# EasyEDA Pro project 3020包裹款控制板V1.1.eprj, schematic 原理图
Board Name: esp32; Create Date: 2025-05-14; Page Name: 电源; Project Name: FluidNC--esp32 -(12-31); Schematic Name: 原理图; Update Date: 2026-01-04; Company: 嘉立创EDA; Page Size: A3; Version: V1.0
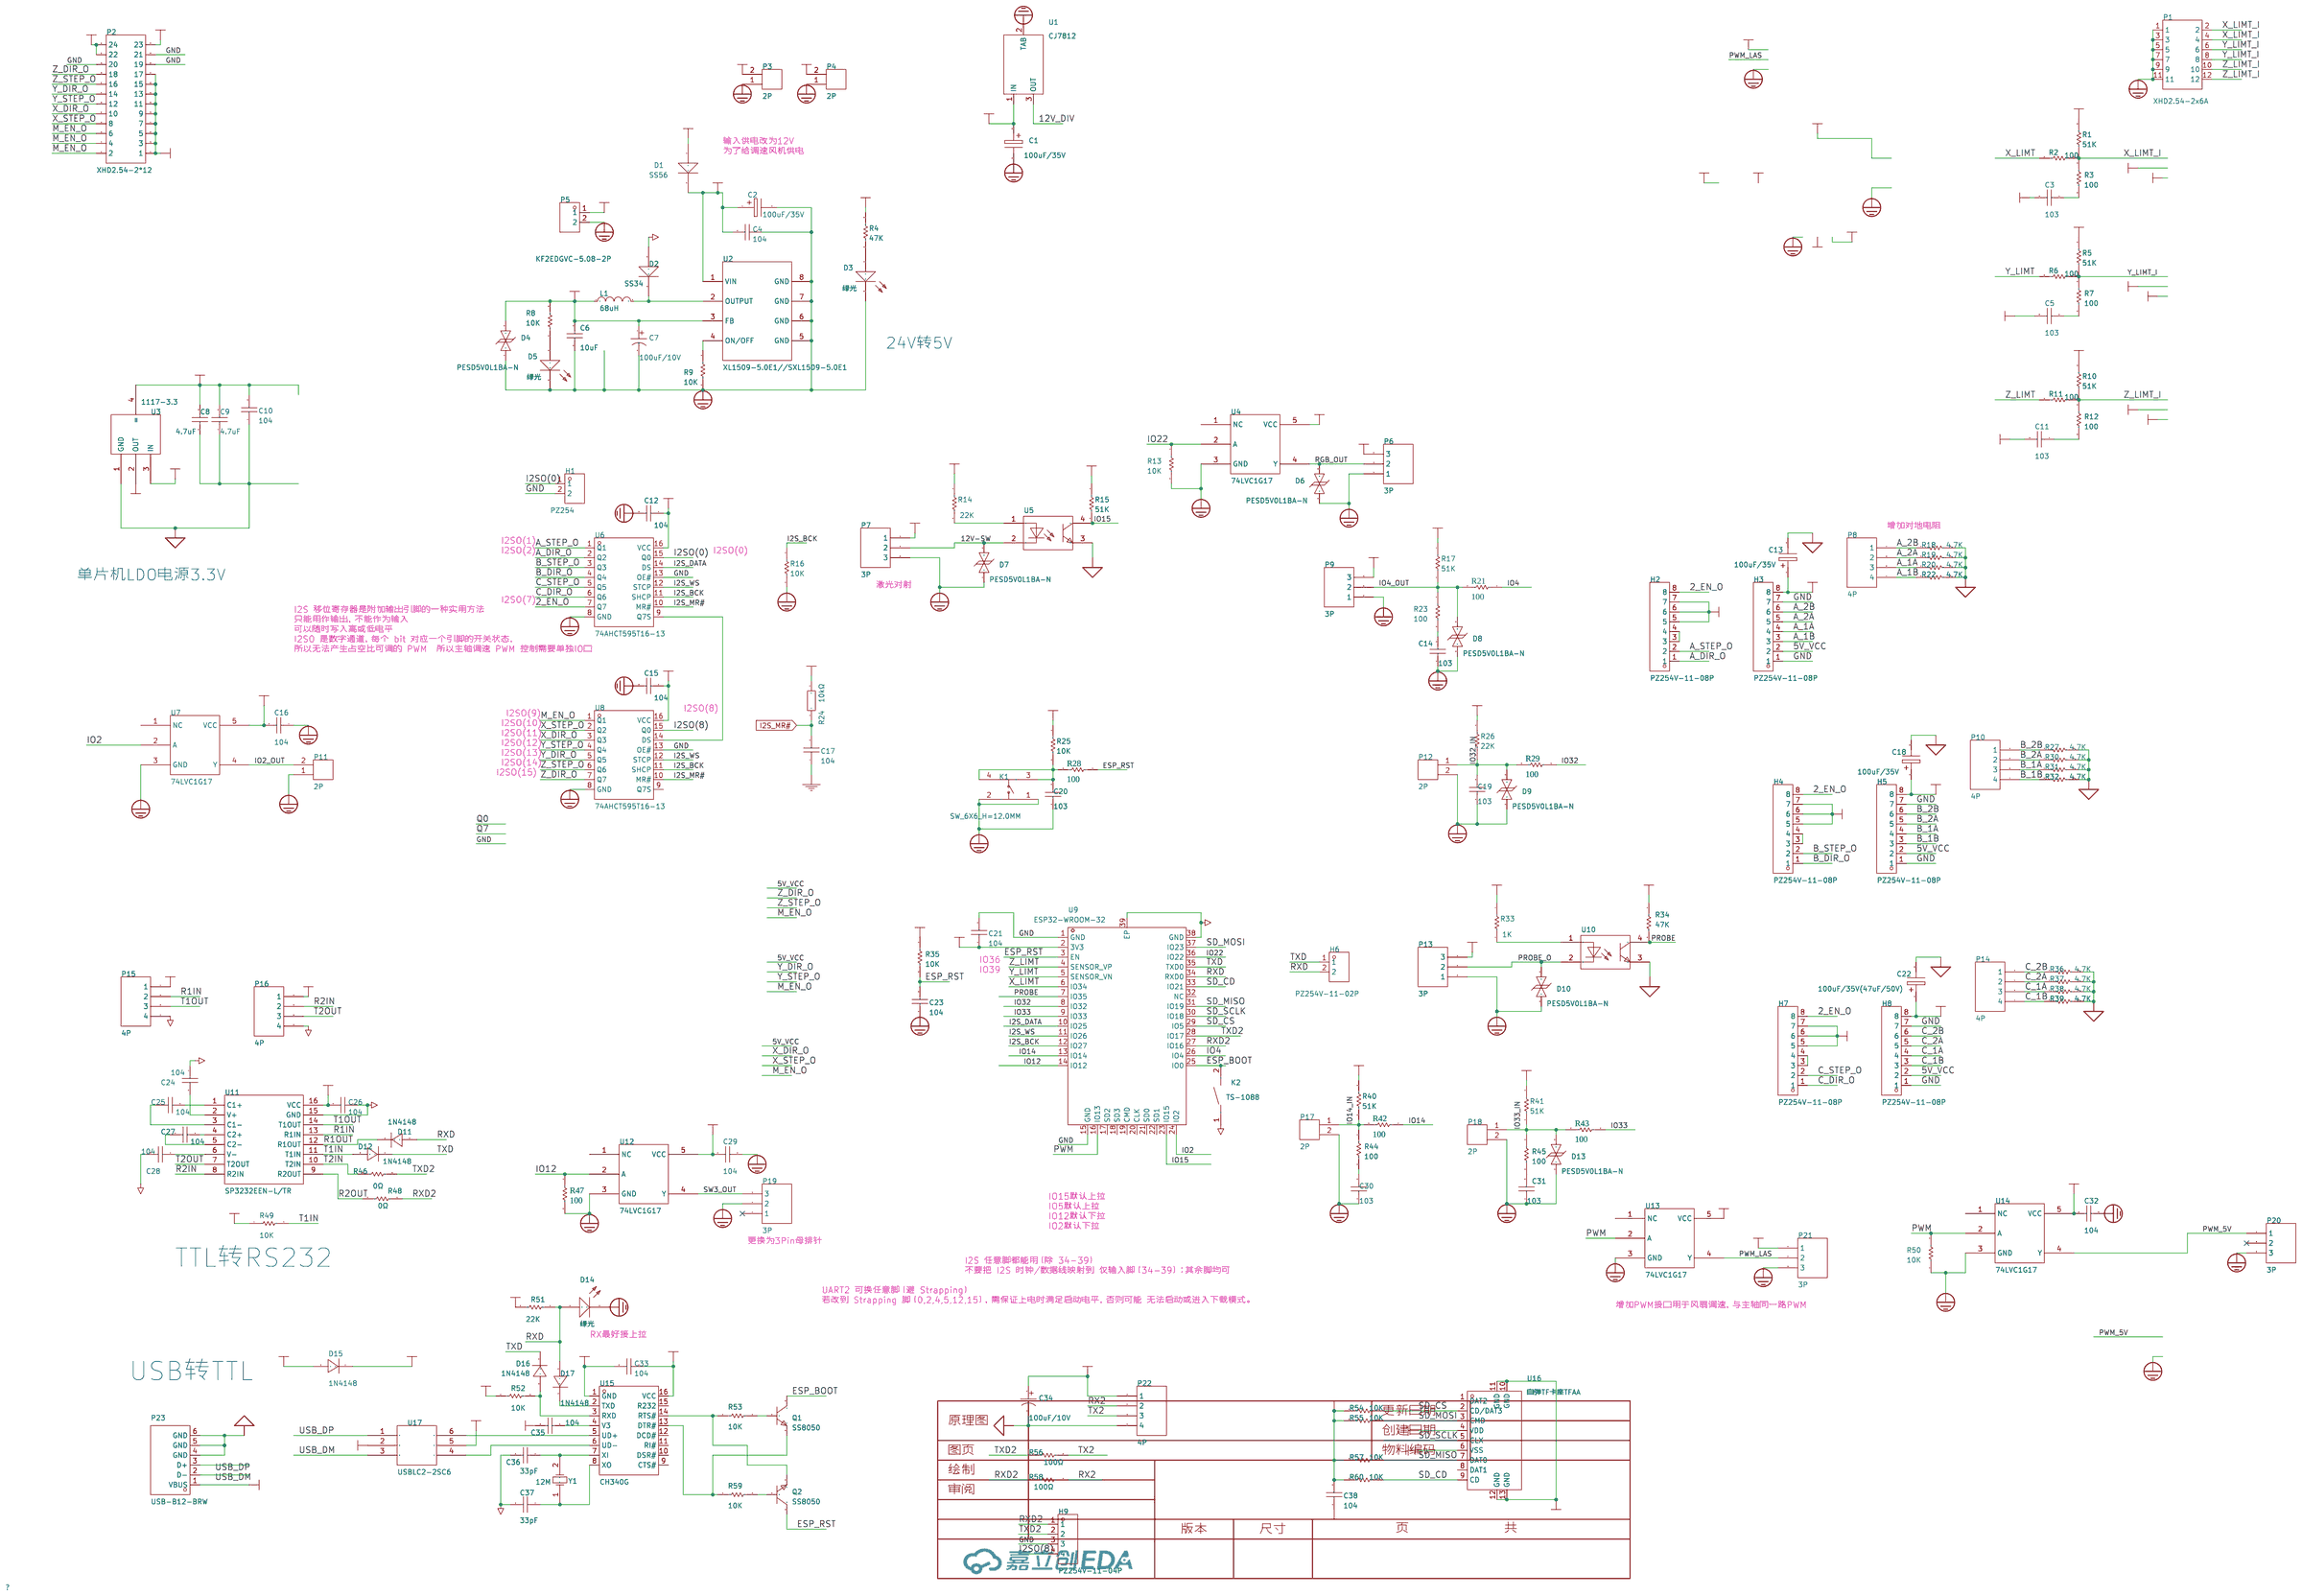
[diagram p0: schematic sheet]

## Parts
C1  100uF/35V  [电解电容贴片6X6]
C2  100uF/35V  [电解电容贴片6X6]
C3  103  [11]
C4  104  [0603C]
C5  103  [11]
C6  10uF  [C1206]
C7  100uF/10V  [CAP-SMD_BD5.0-L5.3-W5.3-RD]
C8  4.7uF  [C1206]
C9  4.7uF  [C1206]
C10  104  [0603C]
C11  103  [11]
C12  104  [0603C]
C13  100uF/35V  [电解电容贴片6X6]
C14  103  [11]
C15  104  [0603C]
C16  104  [0603C]
C17  104  [0603C]
C18  100uF/35V  [电解电容贴片6X6]
C19  103  [11]
C20  103  [11]
C21  104  [0603C]
C22  100uF/35V(47uF/50V)  [电解电容贴片6X6]
C23  104  [0603C]
C24  104  [0603C]
C25  104  [0603C]
C26  104  [0603C]
C27  104  [0603C]
C28  104  [0603C]
C29  104  [0603C]
C30  103  [11]
C31  103  [11]
C32  104  [0603C]
C33  104  [0603C]
C34  100uF/10V  [CAP-SMD_BD5.0-L5.3-W5.3-RD]
C35  104  [0603C]
C36  18pF  [0603C]
C37  18pF  [0603C]
C38  104  [11]
D1  SS56  [SMA]
D2  SS34  [SMA]
D3  绿光  [0603LED]
D4  PESD5V0L1BA-N  [SOD-323_L1.8-W1.3-LS2.5-BI]
D5  绿光  [0603LED]
D6  PESD5V0L1BA-N  [SOD-323_L1.8-W1.3-LS2.5-BI]
D7  PESD5V0L1BA-N  [SOD-323_L1.8-W1.3-LS2.5-BI]
D8  PESD5V0L1BA-N  [SOD-323_L1.8-W1.3-LS2.5-BI]
D9  PESD5V0L1BA-N  [SOD-323_L1.8-W1.3-LS2.5-BI]
D10  PESD5V0L1BA-N  [SOD-323_L1.8-W1.3-LS2.5-BI]
D11  1N4148  [SOD-123_L2.8-W1.8-LS3.7-RD]
D12  1N4148  [SOD-123_L2.8-W1.8-LS3.7-RD]
D13  PESD5V0L1BA-N  [SOD-323_L1.8-W1.3-LS2.5-BI]
D14  绿光  [0603LED]
D15  1N4148  [SOD-123_L2.8-W1.8-LS3.7-RD]
D16  1N4148  [SOD-123_L2.8-W1.8-LS3.7-RD]
D17  1N4148  [SOD-123_L2.8-W1.8-LS3.7-RD]
H1  PZ254  [HDR-TH_2P-P2.54-V-M]
H2  PZ254V-11-08P  [HDR-TH_8P-P2.54-V-M]
H3  PZ254V-11-08P  [HDR-TH_8P-P2.54-V-M]
H4  PZ254V-11-08P  [HDR-TH_8P-P2.54-V-M]
H5  PZ254V-11-08P  [HDR-TH_8P-P2.54-V-M]
H6  PZ254V-11-02P  [HDR-TH_2P-P2.54-V-M]
H7  PZ254V-11-08P  [HDR-TH_8P-P2.54-V-M]
H8  PZ254V-11-08P  [HDR-TH_8P-P2.54-V-M]
H9  PZ254V-11-04P  [HDR-TH_4P-P2.54-V-M]
K1  SW_6X6_H=12.0MM  [KEY-SMD_4P-L6.0-W6.0-P4.50-LS9.0]
K2  TS-1088  [SW-SMD_L3.9-W3.0-P4.45]
L1  68uH  [IND-SMD_L7.0-W7.0_SMDRI74-330MT]
P1  XHD2.54-2x6A  [CONN-TH_12P-P2.50_HC-XHD2.54-2X6A]
P2  XHD2.54-2*12  [IDC-TH_24P-P2.54-V-R2-C12-S2.54]
P3  2P  [HDR1X2_CON]
P4  2P  [HDR1X2_CON]
P5  KF2EDGVC-5.08-2P  [CONN-TH_P5.08_KF2EDGVC-5.08-2P]
P6  3P  [HDR1X3_CON]
P7  3P  [HDR1X3_CON]
P8  4P  [HDR1X4_CON]
P9  3P  [HDR1X3_CON]
P10  4P  [HDR1X4_CON]
P11  2P  [HDR1X2_CON]
P12  2P  [HDR1X2_CON]
P13  3P  [HDR1X3_CON]
P14  4P  [HDR1X4_CON]
P15  4P  [HDR1X4_CON]
P16  4P  [HDR1X4_CON]
P17  2P  [HDR1X2_CON]
P18  2P  [HDR1X2_CON]
P19  3P  [HDR1X3_CON]
P20  3P  [HDR1X3_CON]
P21  3P  [HDR1X3_CON]
P22  4P  [HDR1X4_CON]
P23  USB-B12-BRW  [USB-B-TH_USB-B12-BRW]
Q1  SS8050  [SOT-23-3_L2.9-W1.3-P1.90-LS2.4-BR]
Q2  SS8050  [SOT-23-3_L2.9-W1.3-P1.90-LS2.4-BR]
R1  51K  [10]
R2  100  [10]
R3  100  [10]
R4  47K  [0603R]
R5  51K  [10]
R6  100  [10]
R7  100  [10]
R8  10K  [0603R]
R9  10K  [0603R]
R10  51K  [10]
R11  100  [10]
R12  100  [10]
R13  10K  [0603R]
R14  22K  [0603R]
R15  10K  [0603R]
R16  10K  [0603R]
R17  10K  [0603R]
R18  10K  [0603R]
R19  10K  [0603R]
R20  10K  [0603R]
R21  100  [0603R]
R22  10K  [0603R]
R23  100  [10]
R24  10kΩ  [R0603]
R25  10K  [0603R]
R26  10K  [0603R]
R27  10K  [0603R]
R28  100  [0603R]
R29  100  [0603R]
R30  10K  [0603R]
R31  10K  [0603R]
R32  10K  [0603R]
R33  1K  [0603R]
R34  10K  [0603R]
R35  10K  [0603R]
R36  10K  [0603R]
R37  10K  [0603R]
R38  10K  [0603R]
R39  10K  [0603R]
R40  10K  [0603R]
R41  10K  [0603R]
R42  100  [0603R]
R43  100  [0603R]
R44  100  [10]
R45  100  [10]
R46  0Ω  [0603R]
R47  100  [0603R]
R48  0Ω  [0603R]
R49  10K  [0603R]
R50  10K  [0603R]
R51  10K  [0603R]
R52  10K  [0603R]
R53  10K  [0603R]
R54  10K  [10]
R55  10K  [10]
R56  100Ω  [0603R]
R57  10K  [10]
R58  100Ω  [0603R]
R59  10K  [0603R]
R60  10K  [10]
U1  CJ7812  [TO-263-2_L10.1-W9.1-P5.08-LS15.2-TL]
U2  XL1509-5.0E1//SXL1509-5.0E1  [ESOP-8_L4.9-W3.9-P1.27-LS6.0-BL-EP]
U3  1117-3.3  [SOT-223]
U4  74LVC1G17  [SOT-23-5]
U5  LTV-357T-C  [SOP-4_L4.4-W3.9-P2.54-LS7.0-TL]
U6  74AHCT595T16-13  [TSSOP-16_L5.0-W4.4-P0.65-LS6.4-BL]
U7  74LVC1G17  [SOT-23-5]
U8  74AHCT595T16-13  [TSSOP-16_L5.0-W4.4-P0.65-LS6.4-BL]
U9  ESP32-WROOM-32  [WIFI-SMD_ESP32-WROOM-32UE-A]
U10  LTV-357T-C  [SOP-4_L4.4-W3.9-P2.54-LS7.0-TL]
U11  SP3232EEN-L/TR  [SOIC-16_L9.9-W3.9-P1.27-LS6.0-BL]
U12  74LVC1G17  [SOT-23-5]
U13  74LVC1G17  [SOT-23-5]
U14  74LVC1G17  [SOT-23-5]
U15  CH340G  [SOIC-16_L9.9-W3.9-P1.27-LS6.0-BL]
U16  自弹TF卡座TFAA  [SIM-SMD_C9900015645]
U17  USBLC2-2SC6  [SOT-23-6]
Y1  12M  [晶振贴片49SSMD]

## Library data of the parts
C1 C2 C13 C18 C22 = 100uF/35V: Origin Footprint 2: X47U; Origin Footprint 1: 电解电容贴片6x6; Design Item ID: ELECTRO1; Library Name: *
C3 C5 C11 C14 C19 C20 C30 C31 = 103: Design Item ID: CAP; Library Name: SCH封装库
C4 C10 C12 C15-C17 C21 C23 C29 C32 = 104: Capacitor (Semiconductor SIM Model); Published: 8-Jun-2000; LatestRevisionDate: 17-Jul-2002; LatestRevisionNote: Re-released for DXP Platform.; PackageReference: C1206; Publisher: Altium Limited; Origin Footprint 2: C1206; Origin Footprint 3: 0402; Origin Footprint 4: 1310[0504]; Origin Footprint 5: 1608[0603]; Origin Footprint 6: C1210; Origin Footprint 7: C0805; Origin Footprint 8: C1206; Origin Footprint 9: 0805; Origin Footprint 10: 0805L; Design Item ID: Cap Semi; Library Name: Miscellaneous Devices
C6 C8 C9 = 104: Design Item ID: CAP; Library Name: SCH--װ--
C7 C34 = CS1A101M-CRD54: 容值:100uF;精度:±20%;额定电压:10V;电容体直径:5mm;电容体长度:5.4mm;纹波电流:-;等效串联电阻:-;工作寿命:1000hrs@105℃;工作温度:-40℃~+105℃;; LCSC Part Name: 100uF ±20% 10V; Supplier Part: C96182; Manufacturer: ST(先科); Supplier Footprint: SMD,5x5.4mm; JLCPCB Part Class: Extended Part; Datasheet: https://atta.szlcsc.com/upload/public/pdf/source/20170304/1488621207726.pdf; Supplier: LCSC; Tolerance: ±20%; Rated Voltage: 10V; φD: 5mm; L: 5.4mm; Lifetime @ Temp: 1000hrs@105℃; Operating Temperature: -40℃~+105℃
C24-C28 C33 = 103: Capacitor (Semiconductor SIM Model); Published: 8-Jun-2000; LatestRevisionDate: 17-Jul-2002; LatestRevisionNote: Re-released for DXP Platform.; PackageReference: C1206; Publisher: Altium Limited; Origin Footprint 2: C1206; Origin Footprint 3: 0402; Origin Footprint 4: 1310[0504]; Origin Footprint 5: 1608[0603]; Origin Footprint 6: C1210; Origin Footprint 7: C0805; Origin Footprint 8: C1206; Origin Footprint 9: 0805; Origin Footprint 10: 0805L; Design Item ID: Cap Semi; Library Name: Miscellaneous Devices
C35 = 104: Capacitor (Semiconductor SIM Model); Published: 8-Jun-2000; LatestRevisionDate: 17-Jul-2002; LatestRevisionNote: Re-released for DXP Platform.; PackageReference: C1206; Publisher: Altium Limited; Origin Footprint 2: C1206; Origin Footprint 3: 0402; Origin Footprint 4: 1310[0504]; Origin Footprint 5: 1608[0603]; Origin Footprint 6: C1210; Origin Footprint 7: C0805; Origin Footprint 8: C1206; Origin Footprint 9: 0805; Origin Footprint 10: 0805L; Origin Footprint 11: 0805C; Design Item ID: Cap Semi; Library Name: Miscellaneous Devices
C36 C37 = 33pF: Capacitor (Semiconductor SIM Model); Published: 8-Jun-2000; LatestRevisionDate: 17-Jul-2002; LatestRevisionNote: Re-released for DXP Platform.; PackageReference: C1206; Publisher: Altium Limited; Origin Footprint 2: C1206; Origin Footprint 3: 0402; Origin Footprint 4: 1310[0504]; Origin Footprint 5: 1608[0603]; Origin Footprint 6: C1210; Origin Footprint 7: C0805; Origin Footprint 8: C1206; Origin Footprint 9: 0805; Origin Footprint 10: 0805L; Design Item ID: Cap Semi; Library Name: Miscellaneous Devices
C38 = 104: Capacitor (Semiconductor SIM Model); Published: 8-Jun-2000; LatestRevisionDate: 17-Jul-2002; LatestRevisionNote: Re-released for DXP Platform.; PackageReference: C1206; Publisher: Altium Limited; Origin Footprint 2: C1206; Origin Footprint 3: 0402; Origin Footprint 4: 1310[0504]; Origin Footprint 5: 1608[0603]; Origin Footprint 6: C1210; Origin Footprint 7: C0805; Origin Footprint 8: C1206; Origin Footprint 9: 0805; Origin Footprint 10: 0805L; Origin Footprint 11: 0805C; Origin Footprint 1: 0603C; Design Item ID: Cap Semi; Library Name: Miscellaneous Devices
D1 = SS56: Design Item ID: 1N4148; Library Name: SCH封装库
D2 = SS56: Design Item ID: 1N4148; Library Name: SCH--װ--
D3 D5 D14 = 绿光: Origin Footprint 2: LED(小); Design Item ID: LED; Library Name: SCH封装库
D4 D6-D10 D13 = PESD5V0S1BBN: 极性:Bidirectional;反向关断电压（典型值）:5V (Max);击穿电压（最小值）:6V;箝位电压:15V;峰值脉冲电流（10/1000us）:5A (8/20us);; Supplier Part: C314264; Manufacturer: BORN伯恩半导体; Supplier Footprint: SOD-523; JLCPCB Part Class: Extended Part; Datasheet: https://atta.szlcsc.com/upload/public/pdf/source/20181015/C314264_F9AC5761AC2631DA841FBD1D9C6821E3.pdf; Supplier: LCSC; Polarity: Bidirectional; Voltage - Reverse Standoff (Typ): 5V (Max); Voltage - Breakdown (Min): 6V; Voltage - Clamping (Max) @ Ipp: 15V; Current - Peak Pulse (10/1000μs): 5A (8/20us)
D11 D12 D15-D17 = 1N4148W-E3-08: LCSC Part Name: 100V 150mA 4ns; Supplier Part: C241939; Manufacturer: VISHAY(威世); Supplier Footprint: SOD-123; JLCPCB Part Class: Extended Part; Datasheet: https://atta.szlcsc.com/upload/public/pdf/source/20180719/C241939_AB5601D33C939ACDC04F46818C9B4736.pdf; Supplier: LCSC; Power Dissipation: 350mW; Reverse Voltage (Vr): 100V; Average Rectified Current (Io): 150mA; Forward Voltage (Vf@If): 1.2V@100mA; Reverse Leakage Current: 100μA@100V; Reverse Recovery Time (trr): 4ns; Operating Temperature: +150℃@(Tj)
H1 H6 = PZ254V-11-02P: 插针结构:1x2P;间距:2.54mm;行距:-;圆针/方针:方针;安装类型:直插;排数:单排;总PIN位数:2P;额定电流:-;额定电压:-;配合针长度:6mm;塑高:2.5mm;端接针长度:3mm;触头材质:黄铜;触头镀层:-;工作温度范围:-40℃~+105℃;颜色:黑色;; LCSC Part Name: 间距:2.54mm 1x2P 直插 方针; Supplier Part: C492401; Manufacturer: XFCN(兴飞); Supplier Footprint: 插件,P=2.54mm; JLCPCB Part Class: 扩展库; Datasheet: https://atta.szlcsc.com/upload/public/pdf/source/20200309/C492401_A812433581A9B211A7FFA413ADDFF0E5.pdf; Supplier: LCSC; Pin Structure: 1x2P; Pitch: 2.54mm; Circluar Pins/Square Pins: 方针; Mounting Type: 直插; Number of Rows: 单排; Number of Pins: 2P; Length of Mating Pin: 6mm; Insulation Height: 2.5mm; Length of End Connection Pin: 3mm; Contact Material: 黄铜; Operating Temperature Range: -40℃~+105℃; Color: 黑色
H2-H5 H7 H8 = PZ254V-11-08P: LCSC Part Name: 间距:2.54mm 1x8P 直插 方针; Supplier Part: C492407; Manufacturer: XFCN(兴飞); Supplier Footprint: 插件,P=2.54mm; JLCPCB Part Class: 扩展库; Datasheet: https://atta.szlcsc.com/upload/public/pdf/source/20200309/C492407_83A6FB26A2233368EDB9516968EC6149.pdf; Supplier: LCSC; Pin Structure: 1x8P; Pitch: 2.54mm; Circluar Pins/Square Pins: 方针; Mounting Type: 直插; Number of Rows: 单排; Number of Pins: 8P; Length of Mating Pin: 6mm; Insulation Height: 2.5mm; Length of End Connection Pin: 3mm; Contact Material: 黄铜; Operating Temperature Range: -40℃~+105℃; Color: 黑色
H9 = PZ254V-11-04P: LCSC Part Name: 1x4P 间距:2.54mm 方针 直插; Supplier Part: C2691448; Manufacturer: XFCN(兴飞); Supplier Footprint: 插件,P=2.54mm; JLCPCB Part Class: 扩展库; Datasheet: https://item.szlcsc.com/datasheet/PZ254V-11-04P/2801085.html; Supplier: LCSC; Pin Structure: 1x4P; Pitch: 2.54mm; Circluar Pins/Square Pins: 方针; Mounting Type: 直插; Number of Rows: 单排; Number of Pins: 4P; Current Rating: 3A; Voltage Rating (Max): 250V; Length of Mating Pin: 6mm; Insulation Height: 2.5mm; Length of End Connection Pin: 3mm; Operating Temperature: -40℃~+105℃; Color: 黑色
K1 = SW_6X6_H=12.0MM: Supplier Part: C9900018802; Supplier Footprint: KEY-SMD; JLCPCB Part Class: 扩展库; Supplier: LCSC
K2 = TS-1088-AR02016: 电路结构:单刀单掷;按钮形状:圆形按钮;作用力:160gf;安装方式:立贴;开关长度:4mm;开关宽度:3mm;开关高度:2mm;带支架:不带;触点电流:50mA;额定电压(DC):12V;绝缘电阻:100MΩ;机械寿命:10万次;; LCSC Part Name: 4*3*2mm 立贴 轻触开关; Supplier Part: C720477; Manufacturer: XUNPU(讯普); Supplier Footprint: SMD; JLCPCB Part Class: 基础库; Datasheet: https://atta.szlcsc.com/upload/public/pdf/source/20200810/C720475_60D09DD6C54279ADDB2DC25100F1CC11.pdf; Supplier: LCSC; Circuit: 单刀单掷; Actuator Style: 圆形按钮; Operating Force: 160gf; Mounting Style: 立贴; Switch Length: 4mm; Switch Width: 3mm; Switch Height: 2mm; Strike Gundam: 不带; Contact Current: 50mA; Voltage Rating (DC): 12V; Insulation Resistance: 100MΩ; Actuator/Cap Color: 黑色; Pin Style: SMD接片; Mechanical Life: 10万次; Operating Temperature: -30℃~+80℃
L1 = SMDRI74-330MT: 电感值:33uH;精度:±20%;额定电流:960mA;饱和电流(Isat):1.8A;类型:屏蔽电感;; LCSC Part Name: 33uH±20%1.8A; Supplier Part: C49625; Manufacturer: SXN(顺翔诺); Supplier Footprint: SMD,7.5x7.5mm; JLCPCB Part Class: 扩展库; Datasheet: https://atta.szlcsc.com/upload/public/pdf/source/20210810/6F96FDC19AA308DD2AD166FFB9640E87.pdf; Supplier: LCSC; Tolerance: ±20%; Rated Current: 960mA; Saturation Current (Isat): 1.8A; DC Resistance (DCR): 170mΩ; Type: 屏蔽电感
P1 = HC-XHD2.54-2x6A: 插针结构:2x6P;间距:2.5mm;安装方式:直插;参考系列:-;总PIN数:12P;排数:2;每排PIN数:6;行距:2.5mm;额定电流:3A;触头材质:黄铜;触头镀层:锡;工作温度:-25℃~+85℃;; LCSC Part Name: 米色 2x6P 间距:2.5mm 直插; Supplier Part: C19273889; Manufacturer: HC(虹成电子); Supplier Footprint: 插件,P=2.5mm; JLCPCB Part Class: 扩展库; Datasheet: https://item.szlcsc.com/datasheet/HC-XHD2.54-2x6A/20558439.html; Supplier: LCSC; Pins Structure: 2x6P; Pitch: 2.5mm; Mounting Type: 直插; Number of Pins: 12P; Number of Rows: 2; Number of PINs Per Row: 6; Row Spacing: 2.5mm; Current Rating: 3A; Contact Material: 黄铜; Contact Plating: 锡; Operating Temperature: -25℃~+85℃; Voltage Rating: 250V; Plastic Material: PA66; Color: 米色; Z-Height of the Board: 9.5mm; X-Length of Bottom Edge on Board (Spacing Line): 17.5mm; Y-Width of Bottom Edge on Board: 8.6mm
P2 = 2.54-2*12P直简牛: 连接器类型:简牛座;间距:2.54mm;结构:2x12P;额定电流:1A;安装方式:直插;行距:2.54mm;排数:2;每排PIN数:12;触头材质:黄铜;触头镀层:金;工作温度:-55℃~+105℃;; LCSC Part Name: 2.54mm 2x12P 排数:2 每排P数:12; Supplier Part: C9137; Manufacturer: BOOMELE(博穆精密); Supplier Footprint: 插件,P=2.54mm; JLCPCB Part Class: 扩展库; Datasheet: https://item.szlcsc.com/datasheet/2.54-2*12P%25E7%259B%25B4%25E7%25AE%2580%25E7%2589%259B/9660.html; Supplier: LCSC; Connector Type: 简牛座; Pitch: 2.54mm; Number of Positions or Pins: 2x12P; Current Rating: 1A; Holder Type: 直插; Row Spacing: 2.54mm; Number of Rows: 2; Number of PINs Per Row: 12; Contact Material: 黄铜; Contact Plating: 金; Operating Temperature: -55℃~+105℃; Color: 黑色
P3 P4 P11 P12 P17 P18 = 2P: Library Name: SCH--װ--
P5 = KF2EDGVC-5.08-2P: LCSC Part Name: 5.08mm 1x2P 排数:1 每排P数:2; Supplier Part: C441386; Manufacturer: KEFA(科发); Supplier Footprint: 插件,P=5.08mm; JLCPCB Part Class: 扩展库; Datasheet: https://item.szlcsc.com/datasheet/KF2EDGVC-5.08-2P/441359.html; Supplier: LCSC; Connector Type: 板端/插座-闭口; Number of Positions or Pins: 1x2P; Pitch: 5.08mm; Color: 绿色; Mounting Type: 直针; Number of Pins: 2P; Number of Rows: 1; Number of PINs Per Row: 2; Current Rating: 15A; Voltage Rating (Max): 300V; Operating Temperature: -40℃~+105℃
P6 P7 P9 P13 P19-P21 = 3P: Library Name: SCH封装库
P8 P10 P14-P16 P22 = 4P: Library Name: SCH封装库
P23 = USB-B12-BRW: LCSC Part Name: Type-B 母 直插; Supplier Part: C720550; Manufacturer: XUNPU(讯普); Supplier Footprint: 插件; JLCPCB Part Class: 扩展库; Datasheet: https://item.szlcsc.com/datasheet/USB-B12-BRW/763557.html; Supplier: LCSC; Connector Type: Type-B; Protocol Standard: USB 2.0; Gender: 母; Mounting Type: 直插; Number of Contacts: 4P; Number of Ports: 1; Current Rating-Power: 1.5A; Voltage Rating: 30V; Connect-Disconnect Life: 5千次; Length: 16.1mm; Detection color: 白色; Operating Temperature: -20℃~+70℃
Q1 Q2 = SS8050: LCSC Part Name: NPN 25V 1.5A 120-400 SOT-23; Supplier Part: C2931717; Manufacturer: Doeshare(德芯); Supplier Footprint: SOT-23; JLCPCB Part Class: 扩展库; Datasheet: https://atta.szlcsc.com/upload/public/pdf/source/20220106/99F9A3DFCBDD91265C711555CE6390BF.pdf; Supplier: LCSC
R1 R5 R10 R54 R55 R57 R60 = 10K: Resistor; Published: 8-Jun-2000; LatestRevisionDate: 17-Jul-2002; LatestRevisionNote: Re-released for DXP Platform.; PackageReference: AXIAL-0.3; Publisher: Altium Limited; Origin Footprint 2: AXIAL-0.3; Origin Footprint 3: R0805; Origin Footprint 4: 0805R; Origin Footprint 1: 0603R; Design Item ID: RES; Library Name: SCH封装库
R2 R3 R6 R7 R11 R12 R23 R44 R45 = 100: Resistor; Published: 8-Jun-2000; LatestRevisionDate: 17-Jul-2002; LatestRevisionNote: Re-released for DXP Platform.; PackageReference: AXIAL-0.3; Publisher: Altium Limited; Origin Footprint 2: AXIAL-0.3; Origin Footprint 3: R0805; Origin Footprint 4: 0805R; Origin Footprint 1: 0603R; Design Item ID: RES; Library Name: SCH封装库
R4 = 1K: Resistor; Published: 8-Jun-2000; LatestRevisionDate: 17-Jul-2002; LatestRevisionNote: Re-released for DXP Platform.; PackageReference: AXIAL-0.3; Publisher: Altium Limited; Origin Footprint 2: AXIAL-0.3; Origin Footprint 3: R0805; Origin Footprint 4: 0805R; Design Item ID: RES; Library Name: SCH封装库
R8 R15-R17 R25 R26 R34 R35 R40 R41 R49 R51-R53 R59 = 10K: Resistor; Published: 8-Jun-2000; LatestRevisionDate: 17-Jul-2002; LatestRevisionNote: Re-released for DXP Platform.; PackageReference: AXIAL-0.3; Publisher: Altium Limited; Origin Footprint 2: AXIAL-0.3; Origin Footprint 3: R0805; Origin Footprint 4: 0805R; Design Item ID: RES; Library Name: SCH封装库
R9 = 10k: Resistor; Published: 8-Jun-2000; LatestRevisionDate: 17-Jul-2002; LatestRevisionNote: Re-released for DXP Platform.; PackageReference: AXIAL-0.3; Publisher: Altium Limited; Origin Footprint 2: AXIAL-0.3; Origin Footprint 3: R0805; Origin Footprint 4: 0805R; Design Item ID: RES; Library Name: SCH封装库
R13 R18-R20 R22 R27 R30-R32 R36-R39 R50 = 10K: Resistor; Published: 8-Jun-2000; LatestRevisionDate: 17-Jul-2002; LatestRevisionNote: Re-released for DXP Platform.; PackageReference: AXIAL-0.3; Publisher: Altium Limited; Origin Footprint 2: AXIAL-0.3; Origin Footprint 3: R0805; Origin Footprint 4: 0805R; Design Item ID: RES; Library Name: SCH--װ--
R14 R33 = 470Ω: Resistor; Published: 8-Jun-2000; LatestRevisionDate: 17-Jul-2002; LatestRevisionNote: Re-released for DXP Platform.; PackageReference: AXIAL-0.3; Publisher: Altium Limited; Origin Footprint 2: AXIAL-0.3; Origin Footprint 3: R0805; Origin Footprint 4: 0805R; Design Item ID: RES; Library Name: SCH封装库
R21 R28 R29 R42 R43 R47 = 100: Resistor; Published: 8-Jun-2000; LatestRevisionDate: 17-Jul-2002; LatestRevisionNote: Re-released for DXP Platform.; PackageReference: AXIAL-0.3; Publisher: Altium Limited; Origin Footprint 2: AXIAL-0.3; Origin Footprint 3: R0805; Origin Footprint 4: 0805R; Design Item ID: RES; Library Name: SCH--װ--
R24 = 10kΩ: Supplier: LCSC; Manufacturer: UniOhm; Manufacturer Part: 0603WAF1002T5E; Supplier Part: C25804; Resistance: 10K; JLCPCB Part Class: Basic Part
R46 R48 R56 R58 = 100: Resistor; Published: 8-Jun-2000; LatestRevisionDate: 17-Jul-2002; LatestRevisionNote: Re-released for DXP Platform.; PackageReference: AXIAL-0.3; Publisher: Altium Limited; Origin Footprint 2: AXIAL-0.3; Origin Footprint 3: R0805; Origin Footprint 4: 0805R; Design Item ID: RES; Library Name: SCH封装库
U1 = CJ7812_C145151: 输出类型:固定;工作电压:35V;输出电压:12V;输出电流:1.5A;电源纹波抑制比(PSRR):71dB@(120Hz);输出极性:正极;; LCSC Part Name: 输入35V 输出12V 1.5A; Supplier Part: C145151; Manufacturer: CJ(江苏长电/长晶); Supplier Footprint: TO-263-2; JLCPCB Part Class: 扩展库; Datasheet: https://atta.szlcsc.com/upload/public/pdf/source/20171129/C145151_15119539756991151329.pdf; Supplier: LCSC; Output Type: 固定; Voltage - Supply: 35V; Output Voltage: 12V; Output Current: 1.5A; Power Supply Rejection Ratio (PSRR): 71dB@(120Hz); Voltage Dropout: 2V@(1A); standby current: 4.3mA; Operating Temperature: -25℃~+125℃; Output Configuration: 正极; Number of Outputs: 1
U2 = XL1509-5.0E1: 功能类型:降压型;同步整流:-;输出通道数:-;拓扑结构:-;输入电压:-;输出电流(最大值):-;开关频率:-;; LCSC Part Name: 降压型; Supplier Part: C61063; Manufacturer: XLSEMI(芯龙); Supplier Footprint: SOP-8_150mil; JLCPCB Part Class: Basic Part; Datasheet: https://atta.szlcsc.com/upload/public/pdf/source/20151020/1457707483545.pdf; Supplier: LCSC; Function: 降压型
U3 = 1117-3.3: Design Item ID: LM1117; Library Name: Party600
U4 U7 U12-U14 = 74LVC1G04: Library Name: SCH--װ--
U5 U10 = LTV-357T-C: 输入电压类型:DC;正向电压:1.2V;输出电流:50mA;隔离电压(rms):3.75kV;反向电压:6V;接收端电压:35V;输出通道数:1;集射极饱和电压(Vce(sat)@Ic,IF):200mV@1mA,20mA;; Supplier: LCSC; Manufacturer: LITEON(光宝); Supplier Part: C119091; JLCPCB Part Class: 扩展库; LCSC Part Name: DC输入隔离电压(rms):3750V; Supplier Footprint: SOP-4-2.54mm; Datasheet: https://atta.szlcsc.com/upload/public/pdf/source/20170930/C133128_1506736380934997376.pdf; Input voltage type: DC; Output Type: 光电三极管; Forward Voltage: 1.2V; Output Current: 50mA; Isolation Voltage(rms): 3.75kV; Reverse Voltage: 6V; Receiving End Voltage: 35V; Number of Outputs: 1; Collector-Emitter Saturation Voltage (Vce(sat)@Ic,IF): 200mV@1mA,20mA; Rise time: 4us@2mA,100Ω; Fall time: 3us@2mA,100Ω; Operating Temperature: -55℃~+110℃
U6 U8 = 74AHCT595T16-13: 功能:串行至串行或并行;工作电压:4.5V~5.5V;元件数:1;每个元件位数:8;; Supplier Part: C460504; Manufacturer: DIODES(美台); Supplier Footprint: TSSOP-16; JLCPCB Part Class: 扩展库; Datasheet: https://atta.szlcsc.com/upload/public/pdf/source/20181012/C126402_1C2CD61366A0E74343C8903136947225.pdf; Supplier: LCSC; Function: 串行至串行或并行; Voltage - Supply: 4.5V~5.5V; Number of Elements: 1; Number of Bits per Element: 8; Output Type: 三态; Series: 74AHCT; Operating Temperature: -40℃~+125℃
U9 = ESP32-WROOM-32: Supplier Part: C95209; Manufacturer: ESPRESSIF(乐鑫); JLCPCB Part Class: 扩展库; Datasheet: https://atta.szlcsc.com/upload/public/pdf/source/20170925/C95209_1506321763821990573.pdf; Supplier: LCSC
U11 = SP3232EEN-L/TR: LCSC Part Name: True3.0V至5.5V RS-232收发器; Supplier Part: C9378; Manufacturer: MaxLinear(迈凌); Supplier Footprint: SOIC-16; JLCPCB Part Class: 扩展库; Datasheet: https://item.szlcsc.com/datasheet/SP3232EEN-L%252FTR/9907.html; Supplier: LCSC; Type: 收发器; Number of Drivers: 2; Number of Receivers: 2; Data Rate: 235Kbps; Voltage - Supply: 3V~5.5V; Operating Temperature: -40℃~+85℃
U15 = CH340G: 应用功能:收发器;接口协议:USB 2.0;数据速率:2Mbps;; LCSC Part Name: USB转串口芯片 CH340; Supplier Part: C14267; Manufacturer: WCH(南京沁恒); Supplier Footprint: SOP-16; JLCPCB Part Class: 扩展库; Datasheet: https://atta.szlcsc.com/upload/public/pdf/source/20230530/6E401E9554E9F5311886CC8B3F89B62E.pdf; Supplier: LCSC; Applications Function: 收发器; Protocol: USB 2.0; Supply Voltage: 3.3V；5V; Data Rate: 2Mbps
U16 = 自弹TF卡座TFAA: Supplier Part: C9900015645; Supplier Footprint: SMD; JLCPCB Part Class: 扩展库; Supplier: LCSC
U17 = USBLC2-2SC6: Design Item ID: DIP6; Library Name: SCH封装库
Y1 = 12M: Crystal Oscillator; Published: 8-Jun-2000; LatestRevisionDate: 17-Jul-2002; LatestRevisionNote: Re-released for DXP Platform.; PackageReference: R38; Publisher: Altium Limited; Origin Footprint 2: R38; Origin Footprint 3: XTAL-49S; Design Item ID: XTAL; Library Name: Miscellaneous Devices

## Nets
3V3: C8.2 C9.2 C10.2 C21.1 C38.2 R25.1 R35.1 R51.2 R54.2 R55.2 R57.2 R60.2 U3.2(OUT) U3.4(=) U9.2(3V3) U16.4(VDD)
5V_VCC: C6.1 C7.1 C12.1 C15.1 C16.2 C26.2 C29.2 C32.2 C33.1 C34.1 D4.2 D15.1(K) H2.5 H2.6 H2.7 H3.2 H4.5 H4.6 H4.7 H5.2 H7.5 H7.6 H7.7 H8.2 L1.1 P2.1 P2.3 P2.5 P2.7 P2.9 P2.11 P2.13 P2.15 P2.17 P6.3 P9.3 P13.3 P22.1 R1.2 R5.2 R8.2 R10.2 R15.1 R17.1 R24.2 R26.1 R33.1 R34.1 R40.1 R41.1 R49.1 R52.1 U2.3(FB) U3.3(IN) U4.5(VCC) U6.16(VCC) U7.5(VCC) U8.16(VCC) U11.16(VCC) U12.5(VCC) U13.5(VCC) U14.5(VCC) U15.16(VCC)
12V: C1.1 C13.1 D1.1 H3.8 P2.22 P2.23 P2.24 P3.2 P4.2 P5.1 P7.1 P15.1 P16.1 P21.1 R4.2 R14.1 U1.1(IN)
12V-SW: D7.2 P7.2 U5.2
12V_DIV: C18.1 C22.1 H5.8 H8.8 U1.3(OUT)
GND: C1.2 C2.2 C3.2 C4.1 C5.2 C6.2 C7.2 C8.1 C9.1 C10.1 C11.2 C12.2 C13.2 C14.1 C15.2 C16.1 C17.1 C18.2 C19.1 C20.1 C21.2 C22.2 C23.1 C24.1 C26.1 C28.2 C29.1 C30.1 C31.1 C32.1 C33.2 C34.2 C35.2 C36.2 C37.2 C38.1 D2.1 D3.2 D4.1 D5.2 D6.1 D7.1 D8.1 D9.1 D10.1 D13.1 D14.2 H1.2 H3.1 H3.7 H5.1 H5.7 H8.1 H8.7 H9.3 K1.1 K1.2 K2.1 P1.1 P1.3 P1.5 P1.7 P1.9 P1.11 P2.19 P2.20 P2.21 P3.1 P4.1 P5.2 P6.1 P7.3 P9.1 P11.1 P12.2 P13.1 P15.4 P16.4 P17.2 P18.2 P19.2 P20.3 P21.3 P22.4 P23.4(GND) P23.5(GND) P23.6(GND) R9.2 R13.2 R16.2 R18.2 R19.2 R20.2 R22.2 R27.2 R30.2 R31.2 R32.2 R36.2 R37.2 R38.2 R39.2 R47.2 R50.2 U1.2(TAB) U2.5(GND) U2.6(GND) U2.7(GND) U2.8(GND) U3.1(GND) U4.3(GND) U5.3 U6.8(GND) U6.13(OE#) U7.3(GND) U8.8(GND) U8.13(OE#) U9.1(GND) U9.15(GND) U9.38(GND) U9.39(EP) U10.3 U11.15(GND) U12.3(GND) U13.3(GND) U14.3(GND) U15.1(GND) U16.6(VSS) U16.10(GND) U16.11(GND) U16.12(GND) U16.13(GND) U17.2
VIN_12V: C2.1 C4.2 D1.2 U2.1(VIN)
2_EN_O: H2.8 H4.8 H7.8 U6.7(Q7)
A_1A: H3.4 P8.3 R20.1
A_1B: H3.3 P8.4 R22.1
A_2A: H3.5 P8.2 R19.1
A_2B: H3.6 P8.1 R18.1
A_DIR_O: H2.1 U6.2(Q2)
A_STEP_O: H2.2 U6.1(Q1)
B_1A: H5.4 P10.3 R31.1
B_1B: H5.3 P10.4 R32.1
B_2A: H5.5 P10.2 R30.1
B_2B: H5.6 P10.1 R27.1
B_DIR_O: H4.1 U6.4(Q4)
B_STEP_O: H4.2 U6.3(Q3)
C_1A: H8.4 P14.3 R38.1
C_1B: H8.3 P14.4 R39.1
C_2A: H8.5 P14.2 R37.1
C_2B: H8.6 P14.1 R36.1
C_DIR_O: H7.1 U6.6(Q6)
C_STEP_O: H7.2 U6.5(Q5)
ESP_BOOT: K2.2 Q1.3(C) U9.25(IO0)
ESP_RST: C23.2 Q2.3(C) R28.1 R35.2 U9.3(EN)
I2S_BCK: R16.1 U6.11(SHCP) U8.11(SHCP) U9.12(IO27)
I2S_DATA: U6.14(DS) U9.10(IO25)
I2S_MR#: C17.2 R24.1 U6.10(MR#) U8.10(MR#)
I2S_WS: U6.12(STCP) U8.12(STCP) U9.11(IO26)
I2SO(0): H1.1 U6.15(Q0)
I2SO(8): H9.4 U8.15(Q0)
IO2: U7.2(A) U9.24(IO2)
IO2_OUT: P11.2 U7.4(Y)
IO4: R21.1 U9.26(IO4)
IO4_OUT: D8.2 P9.2 R17.2 R21.2 R23.1
IO12: R47.1 U9.14(IO12) U12.2(A)
IO14: R42.1 U9.13(IO14)
IO14_IN: P17.1 R40.2 R42.2 R44.1
IO15: R15.2 U5.4 U9.23(IO15)
IO22: R13.1 U4.2(A) U9.36(IO22)
IO32: R29.1 U9.8(IO32)
IO32_IN: C19.2 D9.2 P12.1 R26.2 R29.2
IO33: R43.1 U9.9(IO33)
IO33_IN: D13.2 P18.1 R41.2 R43.2 R45.1
M_EN_O: P2.2 P2.4 P2.6 U8.1(Q1)
PROBE: R34.2 U9.7(IO35) U10.4
PROBE_O: D10.2 P13.2 U10.2
PWM: R50.1 U9.16(IO13) U13.2(A) U14.2(A)
PWM_5V: P20.1 U14.4(Y)
PWM_LAS: P21.2 U13.4(Y)
R1IN: P15.2 U11.13(R1IN)
R1OUT: D11.1(K) U11.12(R1OUT)
R2IN: P16.2 U11.8(R2IN)
R2OUT: R48.1 U11.9(R2OUT)
RGB_OUT: D6.2 P6.2 U4.4(Y)
RX2: P22.2 R58.2
RXD: D11.2(A) D14.1 D17.2(A) H6.2 R51.1 U9.34(RXD0)
RXD2: H9.1 R48.2 R58.1 U9.27(IO16)
SD_CD: R60.1 U9.33(IO21) U16.9(CD)
SD_CS: R54.1 U9.29(IO5) U16.2(CD/DAT3)
SD_MISO: R57.1 U9.31(IO19) U16.7(DAT0)
SD_MOSI: R55.1 U9.37(IO23) U16.3(CMD)
SD_SCLK: U9.30(IO18) U16.5(CLX)
SW3_OUT: P19.3 U12.4(Y)
T1IN: D12.2(A) R49.2 U11.11(T1IN)
T1OUT: P15.3 U11.14(T1OUT)
T2IN: R46.1 U11.10(T2IN)
T2OUT: P16.3 U11.7(T2OUT)
TX2: P22.3 R56.2
TXD: D12.1(K) D16.1(K) H6.1 U9.35(TXD0)
TXD2: H9.2 R46.2 R56.1 U9.28(IO17)
USB_DM: P23.2(D-) U17.3
USB_DP: P23.3(D+) U17.1
VUSB: D15.2(A) P23.1(VBUS) U17.5
X_DIR_O: P2.10 U8.3(Q3)
X_LIMT: R2.2 U9.6(IO34)
X_LIMT_I: P1.2 P1.4 R1.1 R2.1 R3.1
X_STEP_O: P2.8 U8.2(Q2)
Y_DIR_O: P2.14 U8.5(Q5)
Y_LIMT: R6.2 U9.5(SENSOR_VN)
Y_LIMT_I: P1.6 P1.8 R5.1 R6.1 R7.1
Y_STEP_O: P2.12 U8.4(Q4)
Z_DIR_O: P2.18 U8.7(Q7)
Z_LIMT: R11.2 U9.4(SENSOR_VP)
Z_LIMT_I: P1.10 P1.12 R10.1 R11.1 R12.1
Z_STEP_O: P2.16 U8.6(Q6)
$9N72390: D2.2 L1.2 U2.2(OUTPUT)
$9N72392: R9.1 U2.4(ON/OFF)
$9N72730: D3.1 R4.1
$9N85928: C35.1 U15.4(V3)
$9N85949: U15.5(UD+) U17.6
$9N85958: U15.6(UD-) U17.4
$9N85962: C36.1 U15.7(XI) Y1.2(OSC2)
$9N85965: C37.1 U15.8(XO) Y1.1(OSC1)
$9N86544: D17.1(K) U15.2(TXD)
$9N86546: D16.2(A) R52.2 U15.3(RXD)
$9N86982: Q1.2(E) R59.1 U15.13(DTR#)
$9N86987: Q2.2(E) R53.1 U15.14(RTS#)
$9N89334: Q1.1(B) R53.2
$9N89338: Q2.1(B) R59.2
$9N98710: C20.2 K1.3 K1.4 R25.2 R28.2
$9N100955: D5.1 R8.1
$9N120731: U6.9(Q7S) U8.14(DS)
$9N144999: R33.2 U10.1
$9N145132: C28.1 U11.6(V-)
$9N145210: C24.2 U11.2(V+)
$9N145285: C27.2 U11.4(C2+)
$9N145289: C27.1 U11.5(C2-)
$9N145296: C25.2 U11.1(C1+)
$9N145300: C25.1 U11.3(C1-)
$9N177844: H2.3 H2.4
$9N190158: H4.3 H4.4
$9N190589: H7.3 H7.4
$9N210537: R14.2 U5.1
$9N249958: C3.1 R3.2
$9N250248: C5.1 R7.2
$9N250310: C11.1 R12.2
$9N250420: C30.2 R44.2
$9N250460: C31.2 R45.2
$9N250602: C14.2 R23.2

Not connected (* = marked no-connect by the designer): P19 1*; P20 2*; U4 1(NC); U7 1(NC); U8 9(Q7S); U9 17(SD2) 18(SD3) 19(CMD) 20(CLK) 21(SD0) 22(SD1) 32(NC); U12 1(NC); U13 1(NC); U14 1(NC); U15 9(CTS#) 10(DSR#) 11(RI#) 12(DCD#) 15(R232); U16 1(DAT2) 8(DAT1)

## Notes on the sheet
- 输入供电改为12V
  为了给调速风机供电
- 24V转5V
- 增加对地电阻
- I2SO(1)
- I2SO(2)
- I2SO(0)
- 单片机LDO电源3.3V
- 激光对射
- I2SO(7)
- I2S 移位寄存器是附加输出引脚的一种实用方法
  只能用作输出，不能作为输入
  可以随时写入高或低电平
  I2SO 是数字通道，每个 bit 对应一个引脚的开关状态，
  所以无法产生占空比可调的 PWM  所以主轴调速 PWM 控制需要单独IO口
- I2SO(8)
- I2SO(10)
- I2SO(9)
- I2SO(11)
- I2SO(12)
- I2SO(13)
- I2SO(14)
- I2SO(15)
- IO36
- IO39
- IO15默认上拉
  IO5默认上拉
  IO12默认下拉
  IO2默认下拉
- 更换为3Pin母排针
- TTL转RS232
- I2S 任意脚都能用（除 34-39）
  不要把 I2S 时钟/数据线映射到 仅输入脚（34-39）；其余脚均可
- UART2 可换任意脚（避 Strapping）
  若改到 Strapping 脚（0,2,4,5,12,15），需保证上电时满足启动电平，否则可能 无法启动或进入下载模式。
- 增加PWM接口用于风扇调速，与主轴同一路PWM
- RX最好接上拉
- USB转TTL
